# EAGLE design rfamp (EAGLE 7.1.0)
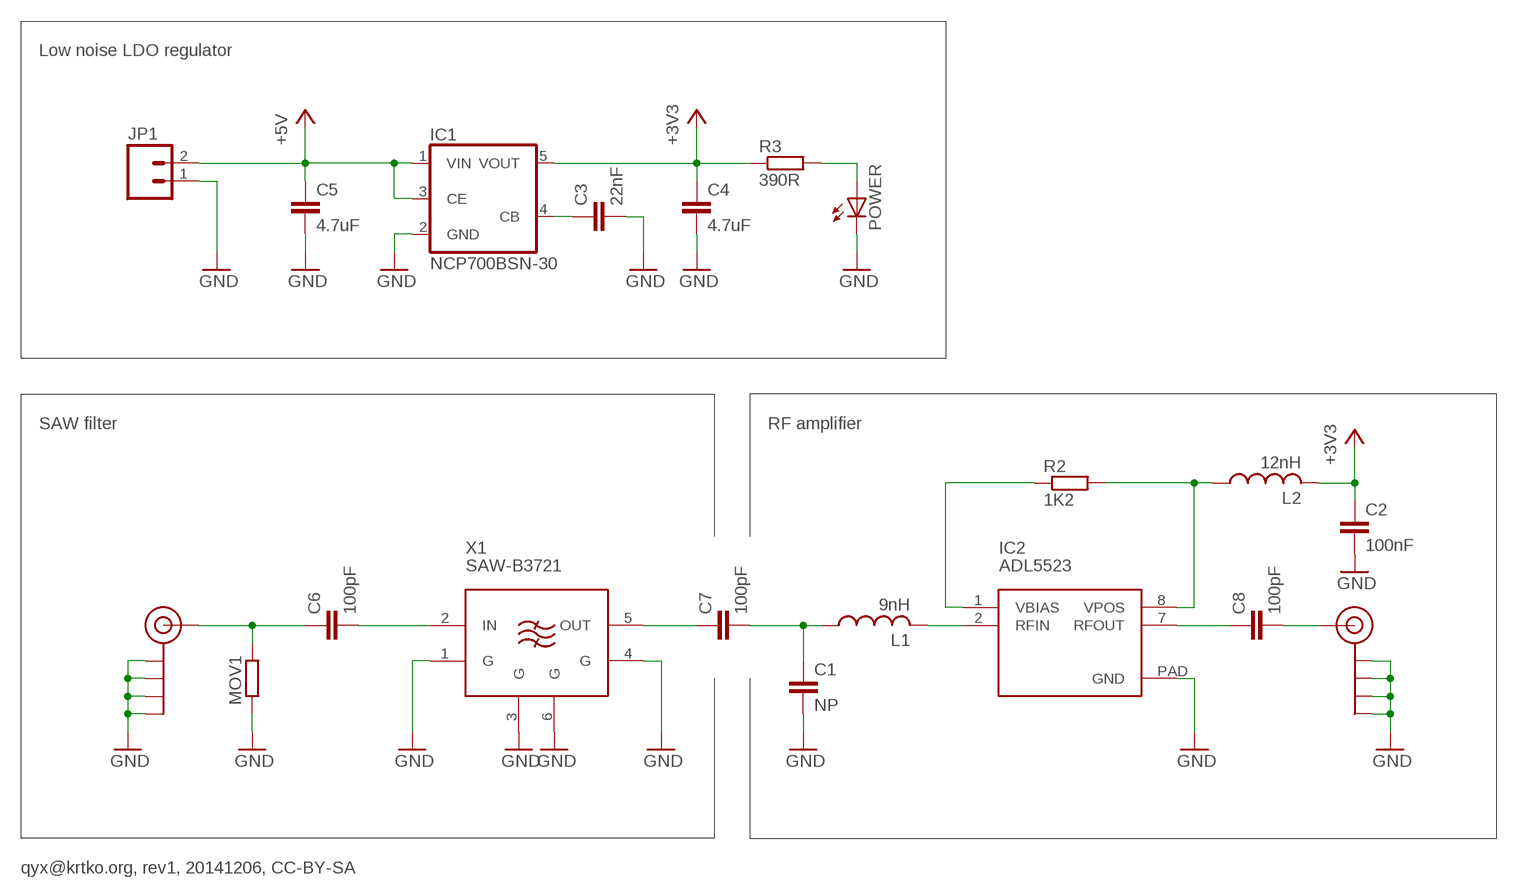
[diagram p0: schematic, sheet 1]

## Parts
C1  NP  C-EUC0603  [C0603]
C2  100nF  C-EUC0603  [C0603]
C3  22nF  C-EUC0603  [C0603]
C4  4.7uF  C-EUC0805  [C0805]
C5  4.7uF  C-EUC0805  [C0805]
C6  100pF  C-EUC0603  [C0603]
C7  100pF  C-EUC0603  [C0603]
C8  100pF  C-EUC0603  [C0603]
IC1  NCP700BSN-30  TS520530  [SOT25]
IC2  ADL5523  [LFCSP_VD_8]
J$1  SMA_EDGE  [SMA-EDGE]
J$2  SMA_EDGE  [SMA-EDGE]
JP1  M02JST-PTH-2  [JST-2-PTH]
L1  9nH  L-USL2012C  [L2012C]
L2  12nH  L-USL2012C  [L2012C]
MOV1  R-EU_R0603  [R0603]
POWER  LEDCHIPLED_0603  [CHIPLED_0603]
R2  1K2  R-EU_R0603  [R0603]
R3  390R  R-EU_R0603  [R0603]
X1  SAW-B3721  [B3721]

## Nets
+3V3: C2.1 C4.1 IC1.5(VOUT) L2.2 R3.1
+5V: C5.1 IC1.1(VIN) IC1.3(CE) JP1.2
GND: C1.2 C2.2 C3.2 C4.2 C5.2 IC1.2(GND) IC2.PAD(GND) J$1.GND@0(GND) J$1.GND@1(GND) J$1.GND@2(GND) J$1.GND@3(GND) J$2.GND@0(GND) J$2.GND@1(GND) J$2.GND@2(GND) J$2.GND@3(GND) JP1.1 MOV1.1 POWER.C X1.1(G) X1.3(G) X1.4(G) X1.6(G)
N$1: C6.1 J$1.SIG(SIGNAL) MOV1.2
N$2: C1.1 C7.2 L1.1
N$3: IC2.8(VPOS) L2.1 R2.2
N$4: IC2.1(VBIAS) R2.1
N$5: IC2.2(RFIN) L1.2
N$6: C8.1 IC2.7(RFOUT)
N$7: POWER.A R3.2
N$8: C3.1 IC1.4(CB)
N$9: C6.2 X1.2(IN)
N$10: C7.1 X1.5(OUT)
N$11: C8.2 J$2.SIG(SIGNAL)

## Notes on the sheet
- Low noise LDO regulator
- SAW filter | RF amplifier
- qyx@krtko.org, rev1, 20141206, CC-BY-SA

## Library data of the parts
C1-C8 = rcl:C-EU: CAPACITOR, European symbol
IC1 = v-reg:TS5205: 150mA Low Noise LDO Voltage Regulator with Enable TSC [Taiwan Semiconductor Company, Ltd] Source: http://www.taiwansemi.com .. 5205_0409c.pdf
IC2 = qyx-misc:ADL5523
J$1 J$2 = SparkFun:SMA_EDGE: SMA Antenna Connector End launch SMA connector. The paste layer has been removed so that the connector can be hand soldered onto the board after reflow.
JP1 = SparkFun:M02: Header 2 Standard 2-pin 0.1" header. Use with straight break away headers (SKU : PRT-00116), right angle break away headers (PRT-00553), swiss pins (PRT-00743), machine pins (PRT-00117), and female headers (PRT-00115). Molex polarized connector foot print use with SKU : PRT-08233 with associated crimp pins and housings.
L1 L2 = rcl:L-US: INDUCTOR, American symbol
MOV1 R2 R3 = rcl:R-EU_: RESISTOR, European symbol
POWER = led:LED: LED OSRAM: - CHIPLED LG R971, LG N971, LY N971, LG Q971, LY Q971, LO R971, LY R971 LH N974, LH R974 LS Q976, LO Q976, LY Q976 LO Q996 - Hyper CHIPLED LW Q18S LB Q993, LB Q99A, LB R99A - SideLED LS A670, LO A670, LY A670, LG A670, LP A670 LB A673, LV A673, LT A673, LW A673 LH A674 LY A675 LS A676, LA A676, LO A676, LY A676, LW A676 LS A679, LY A679, LG A679 - Hyper Micro SIDELED® LS Y876, LA Y876, LO Y876, LY Y876 LT Y87S - SmartLED LW L88C, LW L88S LB L89C, LB L89S, LG L890 LS L89K, LO L89K, LY L89K LS L896, LA L896, LO L896, LY L896 - TOPLED LS T670, LO T670, LY T670, LG T670, LP T670 LSG T670, LSP T670, LSY T670, LOP T670, LYG T670 LG T671, LOG T671, LSG T671 LB T673, LV T673, LT T673, LW T673 LH T674 LS T676, LA T676, LO T676, LY T676, LB T676, LH T676, LSB T676, LW T676 LB T67C, LV T67C, LT T67C, LS T67K, LO T67K, LY T67K, LW E67C LS E67B, LA E67B, LO E67B, LY E67B, LB E67C, LV E67C, LT E67C LW T67C LS T679, LY T679, LG T679 LS T770, LO T770, LY T770, LG T770, LP T770 LB T773, LV T773, LT T773, LW T773 LH T774 LS E675, LA E675, LY E675, LS T675 LS T776, LA T776, LO T776, LY T776, LB T776 LHGB T686 LT T68C, LB T68C - Hyper Mini TOPLED® LB M676 - Mini TOPLED Santana® LG M470 LS M47K, LO M47K, LY M47K Source: http://www.osram.convergy.de LUXEON: - LUMILED® LXK2-PW12-R00, LXK2-PW12-S00, LXK2-PW14-U00, LXK2-PW14-V00 LXK2-PM12-R00, LXK2-PM12-S00, LXK2-PM14-U00 LXK2-PE12-Q00, LXK2-PE12-R00, LXK2-PE12-S00, LXK2-PE14-T00, LXK2-PE14-U00 LXK2-PB12-K00, LXK2-PB12-L00, LXK2-PB12-M00, LXK2-PB14-N00, LXK2-PB14-P00, LXK2-PB14-Q00 LXK2-PR12-L00, LXK2-PR12-M00, LXK2-PR14-Q00, LXK2-PR14-R00 LXK2-PD12-Q00, LXK2-PD12-R00, LXK2-PD12-S00 LXK2-PH12-R00, LXK2-PH12-S00 LXK2-PL12-P00, LXK2-PL12-Q00, LXK2-PL12-R00 Source: www.luxeon.com KINGBRIGHT: KA-3528ASYC Source: www.kingbright.com
X1 = qyx-misc:SAW-B3721

## Net classes
1 waveguide: width 2.6 mm, drill 0.3 mm, clearance 0.8 mm

## Board
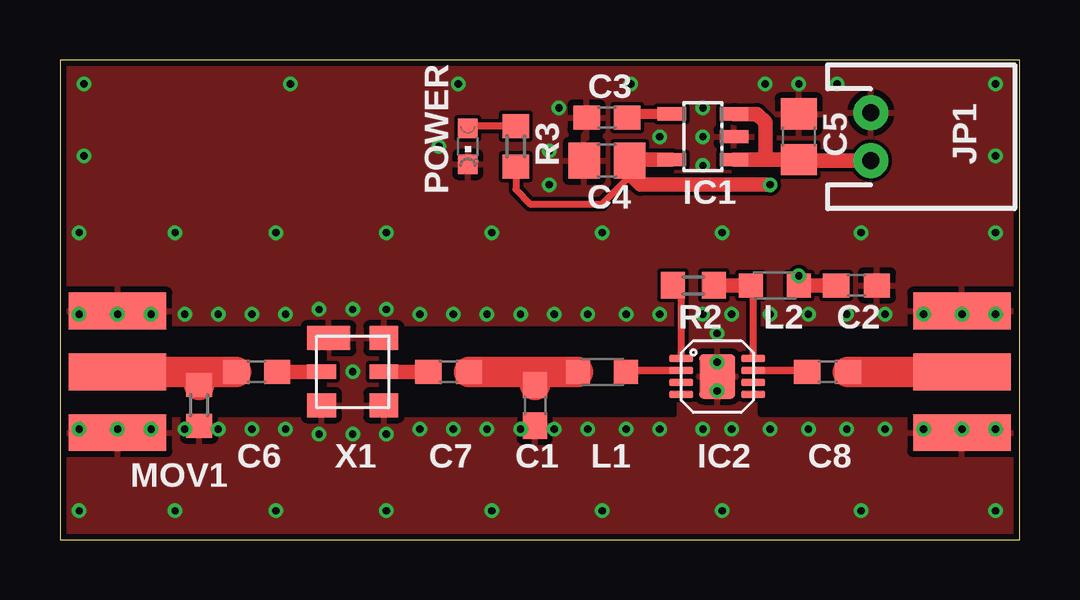
[diagram p1: board, top side]
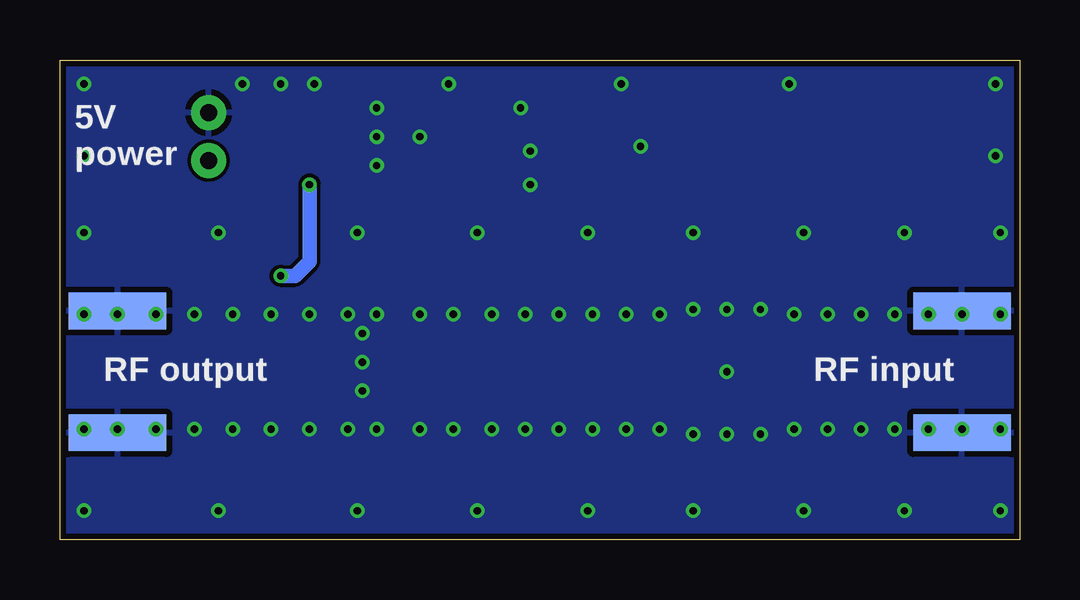
[diagram p2: board, bottom side, seen from below]

Size 40 x 20 mm. Coordinates in mm from the lower left corner, seen from the top.
Outline: 0,0 40,0 40,20 0,20 0,0
Copper layers (1*16): Top 0.035mm / dielectric 1.5mm / Bottom 0.035mm
Design rules "seeed": minimum track width 6mil, minimum drill 0.3mm, track to track 6mil, track to pad 6mil, pad to pad 6mil, via to via 6mil, smd to smd 0mil, copper to edge 10mil, drill to drill 10mil, minimum pad ring 6mil, minimum via ring 6mil, stop-mask expansion 2mil, vias tented up to drill 0.5mm, thermal gap 10mil
tRestrict: area 0.2,5.2 to 11,8.8; area 13.4,5.2 to 25.6,8.8; area 29.2,5.2 to 39.6,8.8

### Footprints (pad centres in the part's own frame; a part is rotated, then mirrored left to right if it is on the bottom)
C0603 = smd 1.1 x 1: 1 -0.85,0; 2 0.85,0
C0805 = smd 1.3 x 1.5: 1 -0.95,0; 2 0.95,0
SOT25 = smd 0.55 x 1.2: 1 -0.95,-1.3; 2 0,-1.3; 3 0.95,-1.3; 4 0.95,1.3; 5 -0.95,1.3
LFCSP_VD_8 = smd 0.3 x 1: 1 -0.75,-1.5; 2 -0.25,-1.5; 3 0.25,-1.5; 4 0.75,-1.5; 5 0.75,1.5; 6 0.25,1.5; 7 -0.25,1.5; 8 -0.75,1.5 | smd 1.85 x 1.5: PAD 0,0
SMA-EDGE = smd 1.524 x 4.064: GND@0 0,0; GND@1 5.08,0; SIG 2.54,0 | smd 1.524 x 4.064 bottom: GND@2 0,0; GND@3 5.08,0
JST-2-PTH = drill 0.7 pad 1.448: 1 -1,0; 2 1,0
L2012C = smd 1 x 1: 1 -1,0; 2 1,0
R0603 = smd 1 x 1.1: 1 -0.85,0; 2 0.85,0
CHIPLED_0603 = smd 0.8 x 0.8: A 0,-0.75; C 0,0.75
B3721 = smd 1 x 1.8: 1 1.4,1 | smd 0.6 x 1.2: 2 0,1.3; 5 0,-1.3 | smd 1 x 1.2: 3 -1.4,1.3; 4 -1.4,-1.3; 6 1.4,-1.3

### Placement (x,y rotation side)
C1  19.8,5.6 270 top
C2  33.2,10.6 0 top
C3  22.8,17.6 180 top
C4  22.8,15.8 180 top
C5  30.8,16.8 90 top
C6  8.2,7 0 top
C7  16.2,7 0 top
C8  32,7 0 top
IC1  26.8,16.8 90 top
IC2  27.4,6.8 270 top
J$1  2.4,4.45 90 top
J$2  37.6,4.45 90 top
JP1  33.8,16.8 270 top
L1  22.6,7 0 top
L2  29.8,10.6 0 top
MOV1  5.8,5.6 90 top
POWER  17,16.4 180 top
R2  26.4,10.6 0 top
R3  19,16.4 90 top
X1  12.2,7 90 top

### Tracks (layer width: path | path; a pad name or v marks a point on that pad's centre or on a via)
+3V3  (via drill 0.3)
  Top 0.3: R3.1 19,14.6 19.6,14 22.6,14 23.8,15.2
  Top 0.61: IC1.5 23.8,15.85 C4.1 23.8,15.75 23.8,15.2 24.2,14.8 v29.6,14.8 | v30.8,11 L2.2 C2.1
  Bottom 0.61: v30.8,11 30.2,11 29.6,11.6 v29.6,14.8
+5V
  Top 0.61: IC1.3 29.05,17.75 29.4,17.4 29.4,15.85 | IC1.1 29.4,15.85 | 29.4,15.85 C5.1 30.85,15.8 JP1.2
GND  (via drill 0.3)
  Top 0.3: v0.8,9.4 v2.4,9.4 v3.8,9.4 | v0.8,4.6 v2.4,4.6 v3.8,4.6
  Top 0.305: v36,9.4 v37.6,9.4 v39,9.4 | v36,4.6 v37.6,4.6 v39,4.6
  other vias: 0.8,1.2 5.2,4.6 6.6,4.6 8,4.6 9.4,4.6 10.8,4.4 12.2,4.4 5.2,9.4 6.6,9.4 8,9.4 9.4,9.4 10.8,9.6 12.2,9.6 13.6,9.6 15,9.4 16.4,9.4 17.8,9.4 19.2,9.4 20.6,9.4 22,9.4 23.6,9.4 25,9.4 26.8,9.4 28,9.4 29.6,9.4 13.6,4.4 15,4.6 16.4,4.6 17.8,4.6 19.2,4.6 20.6,4.6 22,4.6 23.6,4.6 25,4.6 26.8,4.6 28,4.6 29.6,4.6 4.8,1.2 9,1.2 13.6,1.2 18,1.2 22.6,1.2 27.6,1.2 33.4,1.2 39,1.2 0.8,12.8 4.8,12.8 9,12.8 13.6,12.8 18,12.8 22.6,12.8 27.6,12.8 33.4,12.8 39,12.8 26.8,15.6 26.8,16.8 26.8,18 39,19 32.4,19 30.8,19 29.4,19 23.8,19 20.4,14.8 20.4,16.2 20.8,18 16.6,19 9.6,19 1,19 1,16 39,16 27.4,8.6 27.4,7.4 27.4,6.2 31.2,9.4 32.8,9.4 31.2,4.6 32.8,4.6 25,16.8 15.8,16.4 12.2,7 34.4,9.4 34.4,4.6
  pour Top: 0,0 40,0 40,20 0,20
  pour Bottom: 0,0 40,0 40,20 0,20
N$1
  Top 1.27: J$1.SIG 5.8,6.99 | 5.8,6.99 C6.1 | MOV1.2 5.8,6.99
N$2
  Top 1.27: L1.1 20,7 | 20,7 C7.2 | C1.1 19.8,6.8 20,7
N$3
  Top 0.3: IC2.8 28.9,10.5 L2.1
  Top 0.61: L2.1 R2.2
N$4
  Top 0.3: IC2.1 25.9,10.25 R2.1
N$5
  Top 0.305: IC2.2 23.65,7.05 L1.2
N$6
  Top 0.305: IC2.7 31.1,7.05 C8.1
N$7
  Top 0.3: R3.2 17.1,17.25 POWER.A
N$8
  Top 0.406: IC1.4 23.8,17.75 C3.1
N$9
  Top 0.61: X1.2 C6.2
N$10
  Top 0.61: X1.5 C7.1
N$11
  Top 1.27: C8.2 J$2.SIG

### Text on the board
bNames: 5V / power | RF input | RF output